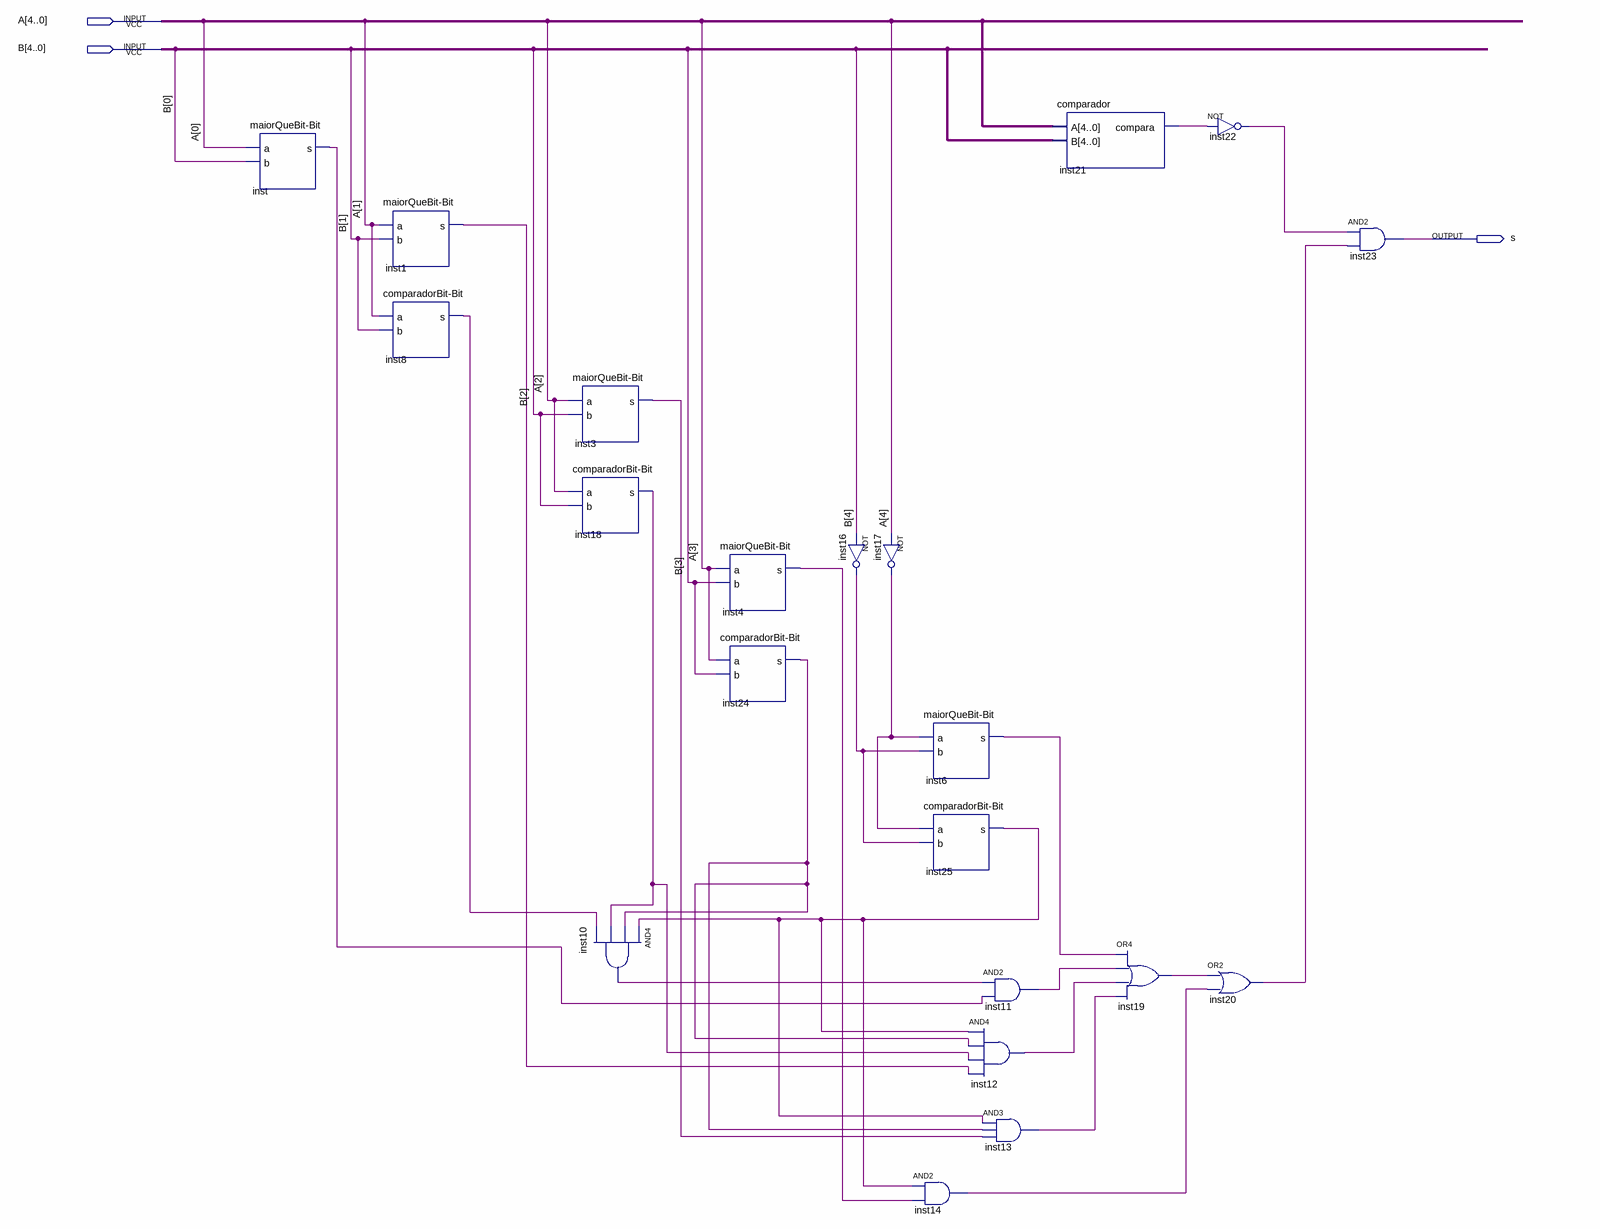
[diagram p0: schematic sheet]
// Quartus schematic maiorQue.bdf as structural Verilog: 21 symbols, 3 pins
module maiorQue (
  input  [4:0] A,
  input  [4:0] B,
  output s
);

  wire inst1_s, inst3_s, inst4_s, inst6_s, inst8_s, inst10_out, inst11_out, inst12_out, inst13_out,
       inst14_out, inst16_out, inst17_out, inst18_s, inst19_out, inst20_out, inst21_compara, inst22_out,
       inst24_s, inst25_s, inst_s;

  \maiorQueBit-Bit  inst (.a(A[0]), .b(B[0]), .s(inst_s));
  \maiorQueBit-Bit  inst1 (.a(A[1]), .b(B[1]), .s(inst1_s));
  \comparadorBit-Bit  inst8 (.a(A[1]), .b(B[1]), .s(inst8_s));
  \maiorQueBit-Bit  inst3 (.a(A[2]), .b(B[2]), .s(inst3_s));
  \comparadorBit-Bit  inst18 (.a(A[2]), .b(B[2]), .s(inst18_s));
  and inst10 (inst10_out, inst25_s, inst24_s, inst18_s, inst8_s);
  \maiorQueBit-Bit  inst4 (.a(A[3]), .b(B[3]), .s(inst4_s));
  \comparadorBit-Bit  inst24 (.a(A[3]), .b(B[3]), .s(inst24_s));
  not inst16 (inst16_out, B[4]);
  not inst17 (inst17_out, A[4]);
  \maiorQueBit-Bit  inst6 (.a(inst17_out), .b(inst16_out), .s(inst6_s));
  \comparadorBit-Bit  inst25 (.a(inst17_out), .b(inst16_out), .s(inst25_s));
  and inst14 (inst14_out, inst25_s, inst4_s);
  and inst12 (inst12_out, inst25_s, inst24_s, inst18_s, inst1_s);
  and inst11 (inst11_out, inst10_out, inst_s);
  and inst13 (inst13_out, inst25_s, inst24_s, inst3_s);
  comparador inst21 (.A(A), .B(B), .compara(inst21_compara));
  or inst19 (inst19_out, inst6_s, inst11_out, inst12_out, inst13_out);
  not inst22 (inst22_out, inst21_compara);
  or inst20 (inst20_out, inst19_out, inst14_out);
  and inst23 (s, inst22_out, inst20_out);
endmodule
